# Altium schematic sheet lcd.SchDoc: Parallella LCD Board
size A4; Author: Mateusz Majchrzycki; CompanyName: Antmicro Ltd; Address1: Zwierzyniecka 3; Address2: 60-813 Poznań; Address3: Poland; Address4: 60-813 Poznań, Poland; Revision: 2.1; SheetNumber: 2; SheetTotal: 2; PageSetup: Record=PageOptions|CenterHorizontal=True|CenterVertical=True|PrintScale=0.97|XCorrection=1.00|YCorrection=1.00|PrintKind=1|BorderSize=5000000|LeftOffset=0|BottomOffset=0|Orientation=2|PaperLength=2970|PaperWidth=2100|Scale=100|PaperSource=7|PrintQuality=600|MediaType=1|DitherType=10|PaperKind=A4|PrintScaleMode=1
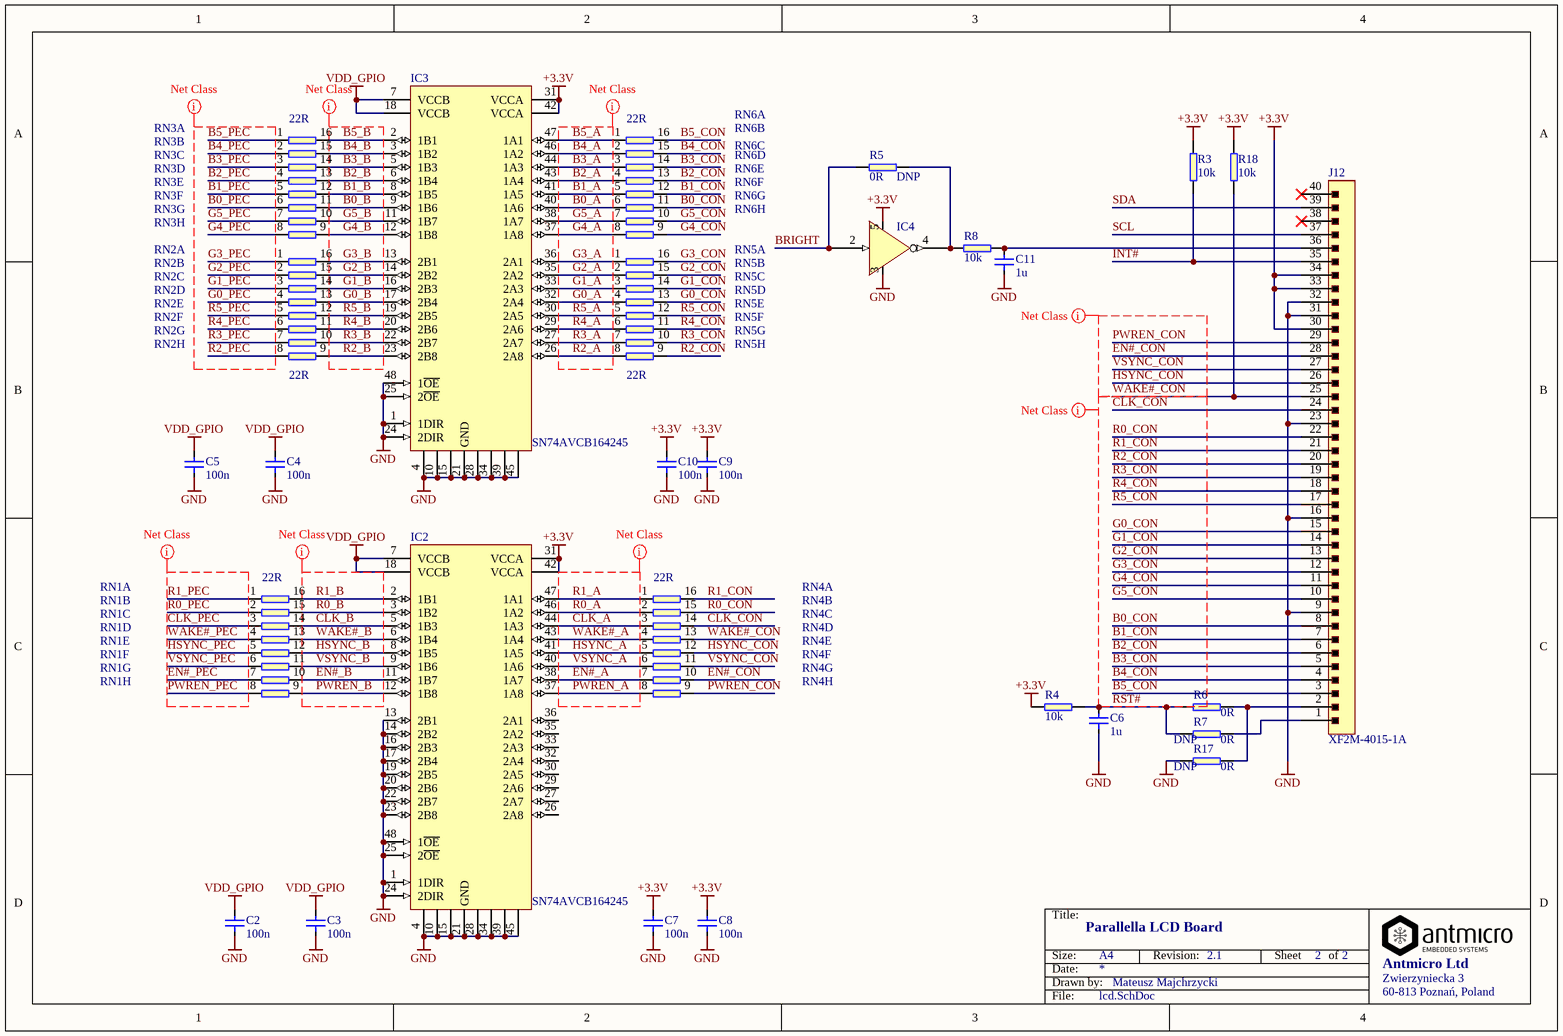
[diagram p0: lcd.SchDoc]

## Parts
C2  100n  [0603]
C3  100n  [0603]
C4  100n  [0603]
C5  100n  [0603]
C6  1u  [0603]
C7  100n  [0603]
C8  100n  [0603]
C9  100n  [0603]
C10  100n  [0603]
C11  1u  [0603]
IC2  SN74AVCB164245  [TSSOP40P640X120-48N]
IC3  SN74AVCB164245  [TSSOP40P640X120-48N]
IC4  SN74AUC1G04  [SC70-5]  (value not drawn)
J12  XF2M-4015-1A  [XF2M-4015-1A]
R3  10k  [0603]
R4  10k  [0603]
R5  DNP  value 0R  [0603]
R6  0R  [0603]
R7  DNP  value 0R  [0603]
R8  10k  [0603]
R17  DNP  value 0R  [0603]
R18  10k  [0603]
RN1  22R  [EXB2HV]  (parts A,B,C,D,E,F,G,H of 8)
RN2  22R  [EXB2HV]  (parts A,B,C,D,E,F,G,H of 8)
RN3  22R  [EXB2HV]  (parts A,B,C,D,E,F,G,H of 8)
RN4  22R  [EXB2HV]  (parts A,B,C,D,E,F,G,H of 8)
RN5  22R  [EXB2HV]  (parts A,B,C,D,E,F,G,H of 8)
RN6  22R  [EXB2HV]  (parts A,B,C,D,E,F,G,H of 8)

## Nets
+3.3V: C7.2 C8.2 C9.2 C10.2 IC2.31(VCCA) IC2.42(VCCA) IC3.31(VCCA) IC3.42(VCCA) IC4.5(VCC) J12.30 J12.33 J12.34 R3.2 R4.1 R18.2
GND: C2.1 C3.1 C4.1 C5.1 C6.1 C7.1 C8.1 C9.1 C10.1 C11.1 IC2.1(1DIR) IC2.4(GND) IC2.10(GND) IC2.13(2B1) IC2.14(2B2) IC2.15(GND) IC2.16(2B3) IC2.17(2B4) IC2.19(2B5) IC2.20(2B6) IC2.21(GND) IC2.22(2B7) IC2.23(2B8) IC2.24(2DIR) IC2.25(2~{OE}) IC2.28(GND) IC2.34(GND) IC2.39(GND) IC2.45(GND) IC2.48(1~{OE}) IC3.1(1DIR) IC3.4(GND) IC3.10(GND) IC3.15(GND) IC3.21(GND) IC3.24(2DIR) IC3.25(2~{OE}) IC3.28(GND) IC3.34(GND) IC3.39(GND) IC3.45(GND) IC3.48(1~{OE}) IC4.3(GND) J12.9 J12.16 J12.23 J12.31 J12.32 R17.1
VDD_GPIO: C2.2 C3.2 C4.2 C5.2 IC2.7(VCCB) IC2.18(VCCB) IC3.7(VCCB) IC3.18(VCCB)
B0_A: IC3.40(1A6) RN6.6
B0_B: IC3.9(1B6) RN3.11
B0_CON: J12.8 RN6.11
B0_PEC: RN3.6
B1_A: IC3.41(1A5) RN6.5
B1_B: IC3.8(1B5) RN3.12
B1_CON: J12.7 RN6.12
B1_PEC: RN3.5
B2_A: IC3.43(1A4) RN6.4
B2_B: IC3.6(1B4) RN3.13
B2_CON: J12.6 RN6.13
B2_PEC: RN3.4
B3_A: IC3.44(1A3) RN6.3
B3_B: IC3.5(1B3) RN3.14
B3_CON: J12.5 RN6.14
B3_PEC: RN3.3
B4_A: IC3.46(1A2) RN6.2
B4_B: IC3.3(1B2) RN3.15
B4_CON: J12.4 RN6.15
B4_PEC: RN3.2
B5_A: IC3.47(1A1) RN6.1
B5_B: IC3.2(1B1) RN3.16
B5_CON: J12.3 RN6.16
B5_PEC: RN3.1
BRIGHT: IC4.2(IN) R5.2
CLK_A: IC2.44(1A3) RN4.3
CLK_B: IC2.5(1B3) RN1.14
CLK_CON: J12.24 RN4.14
CLK_PEC: RN1.3
EN#_A: IC2.38(1A7) RN4.7
EN#_B: IC2.11(1B7) RN1.10
EN#_CON: J12.28 RN4.10
EN#_PEC: RN1.7
G0_A: IC3.32(2A4) RN5.4
G0_B: IC3.17(2B4) RN2.13
G0_CON: J12.15 RN5.13
G0_PEC: RN2.4
G1_A: IC3.33(2A3) RN5.3
G1_B: IC3.16(2B3) RN2.14
G1_CON: J12.14 RN5.14
G1_PEC: RN2.3
G2_A: IC3.35(2A2) RN5.2
G2_B: IC3.14(2B2) RN2.15
G2_CON: J12.13 RN5.15
G2_PEC: RN2.2
G3_A: IC3.36(2A1) RN5.1
G3_B: IC3.13(2B1) RN2.16
G3_CON: J12.12 RN5.16
G3_PEC: RN2.1
G4_A: IC3.37(1A8) RN6.8
G4_B: IC3.12(1B8) RN3.9
G4_CON: J12.11 RN6.9
G4_PEC: RN3.8
G5_A: IC3.38(1A7) RN6.7
G5_B: IC3.11(1B7) RN3.10
G5_CON: J12.10 RN6.10
G5_PEC: RN3.7
HSYNC_A: IC2.41(1A5) RN4.5
HSYNC_B: IC2.8(1B5) RN1.12
HSYNC_CON: J12.26 RN4.12
HSYNC_PEC: RN1.5
INT#: J12.35 R3.1
PWREN_A: IC2.37(1A8) RN4.8
PWREN_B: IC2.12(1B8) RN1.9
PWREN_CON: J12.29 RN4.9
PWREN_PEC: RN1.8
R0_A: IC2.46(1A2) RN4.2
R0_B: IC2.3(1B2) RN1.15
R0_CON: J12.22 RN4.15
R0_PEC: RN1.2
R1_A: IC2.47(1A1) RN4.1
R1_B: IC2.2(1B1) RN1.16
R1_CON: J12.21 RN4.16
R1_PEC: RN1.1
R2_A: IC3.26(2A8) RN5.8
R2_B: IC3.23(2B8) RN2.9
R2_CON: J12.20 RN5.9
R2_PEC: RN2.8
R3_A: IC3.27(2A7) RN5.7
R3_B: IC3.22(2B7) RN2.10
R3_CON: J12.19 RN5.10
R3_PEC: RN2.7
R4_A: IC3.29(2A6) RN5.6
R4_B: IC3.20(2B6) RN2.11
R4_CON: J12.18 RN5.11
R4_PEC: RN2.6
R5_A: IC3.30(2A5) RN5.5
R5_B: IC3.19(2B5) RN2.12
R5_CON: J12.17 RN5.12
R5_PEC: RN2.5
RST#: C6.2 R4.2 R6.1 R7.1
SCL: J12.37
SDA: J12.39
VSYNC_A: IC2.40(1A6) RN4.6
VSYNC_B: IC2.9(1B6) RN1.11
VSYNC_CON: J12.27 RN4.11
VSYNC_PEC: RN1.6
WAKE#_A: IC2.43(1A4) RN4.4
WAKE#_B: IC2.6(1B4) RN1.13
WAKE#_CON: J12.25 R18.1 RN4.13
WAKE#_PEC: RN1.4
NetC11_2: C11.2 J12.36 R8.1
NetIC4_4: IC4.4(OUT) R5.1 R8.2
NetJ12_1: J12.1 R7.2
NetJ12_2: J12.2 R6.2 R17.2

Not connected (* = marked no-connect by the designer): IC2 26(2A8) 27(2A7) 29(2A6) 30(2A5) 32(2A4) 33(2A3) 35(2A2) 36(2A1); J12 38* 40*

## Layout directives
net class LCD_Signals_A: B0_A, B1_A, B2_A, B3_A, B4_A, B5_A, CLK_A, EN#_A, G0_A, G1_A, G2_A, G3_A, G4_A, G5_A, HSYNC_A, PWREN_A, R0_A, R1_A, R2_A, R3_A, R4_A, R5_A, VSYNC_A, WAKE#_A
net class LCD_Signals_CON: B0_CON, B1_CON, B2_CON, B3_CON, B4_CON, B5_CON, CLK_CON, EN#_CON, G0_CON, G1_CON, G2_CON, G3_CON, G4_CON, G5_CON, HSYNC_CON, PWREN_CON, R0_CON, R1_CON, R2_CON, R3_CON, R4_CON, R5_CON, RST#, VSYNC_CON, WAKE#_CON
net class LCD_Signals_B: B0_B, B1_B, B2_B, B3_B, B4_B, B5_B, CLK_B, EN#_B, G0_B, G1_B, G2_B, G3_B, G4_B, G5_B, HSYNC_B, PWREN_B, R0_B, R1_B, R2_B, R3_B, R4_B, R5_B, VSYNC_B, WAKE#_B
net class LCD_Signals_PEC: B0_PEC, B1_PEC, B2_PEC, B3_PEC, B4_PEC, B5_PEC, CLK_PEC, EN#_PEC, G0_PEC, G1_PEC, G2_PEC, G3_PEC, G4_PEC, G5_PEC, HSYNC_PEC, PWREN_PEC, R0_PEC, R1_PEC, R2_PEC, R3_PEC, R4_PEC, R5_PEC, VSYNC_PEC, WAKE#_PEC

## Notes on the sheet
- Title:
- Size:
- Date:
- Drawn by:
- A4
- Revision:
- Sheet
- of
- File:

## Library data of the parts
C2-C5 C7-C10 = C_100n_0603: MLCC SMT Capacitor 100nF 0603; Tolerance: 5%; Value: 100n; Part Number: C_100n_0603; Component type: standard; Pin count: 2; Supplier 1: Farnell; Supplier Part Number 1: 2332586
C6 C11 = C_1u_0603: MLCC SMT Capacitor 1uF 0603; Value: 1u; Supplier 1: Farnell; Supplier Part Number 1: 2309013; Part Number: C_1u_0603; Component type: standard; Pin count: 2
IC2 IC3 = SN74AVCB164245GR: SN74AVCB164245GR - IC, NON INVERTING TRANSCEIVER, TSSOP-48; Value: SN74AVCB164245; Supplier 1: Farnell; Supplier Part Number 1: 2412294; Part Number: SN74AVCB164245GR; Component Kind: Standard; Component Type: Standard; Pin Count: 48; Supplier 4: Arrow; Supplier Part Number 4: SN74AVCB164245GR
IC4 = SN74AUC1G04: LOGIC, INVERTER GATE, SC-70-5; Value: SN74AUC1G04DCKR; Supplier 1: Farnell; Supplier 2: Mouser; Supplier Part Number 1: 2334905; Supplier Part Number 2: 595-SN74AUC1G04DCKR; Component Type: Standard; Pin Count: 4
J12 = XF2M-4015-1A: RECEPTACLE, FPC, ZIF, SMT, 0.5MM, 40WAY; Part Number: XF2M-4015-1A; Component Kind: Standard; Component Type: Standard; Designator: XF2M-4015-1A; Pin Count: 40; Supplier 1: Farnell; Supplier Part Number 1: 1112562; Value: XF2M-4015-1A
R3 R4 R8 R18 = R_10k_0603: SMT Resistor 10k 0603; Value: 10k; Supplier 1: Farnell; Supplier Part Number 1: 2008360; Part Number: R_10k_0603; Component type: standard; Pin count: 2
R5-R7 R17 = R_0R_0603: SMT Resistor 0R 0603; Tolerance: 5%; Supplier 1: Farnell; Supplier Part Number 1: 2008343; Part Number: R_0R_0603; Component type: standard; Pin count: 2
  R6: Value: 0R
RN1-RN6 = Rnet22R: Resistor network 8x0402; Part Number: Rnet22R; Component Kind: Standard; Component Type: Standard; Library Reference: EXB2HV; Pin Count: 16; Value: 22R; Supplier 1: Farnell; Supplier Part Number 1: 2060065